# Altium schematic sheet Connectors.SchDoc
size Letter
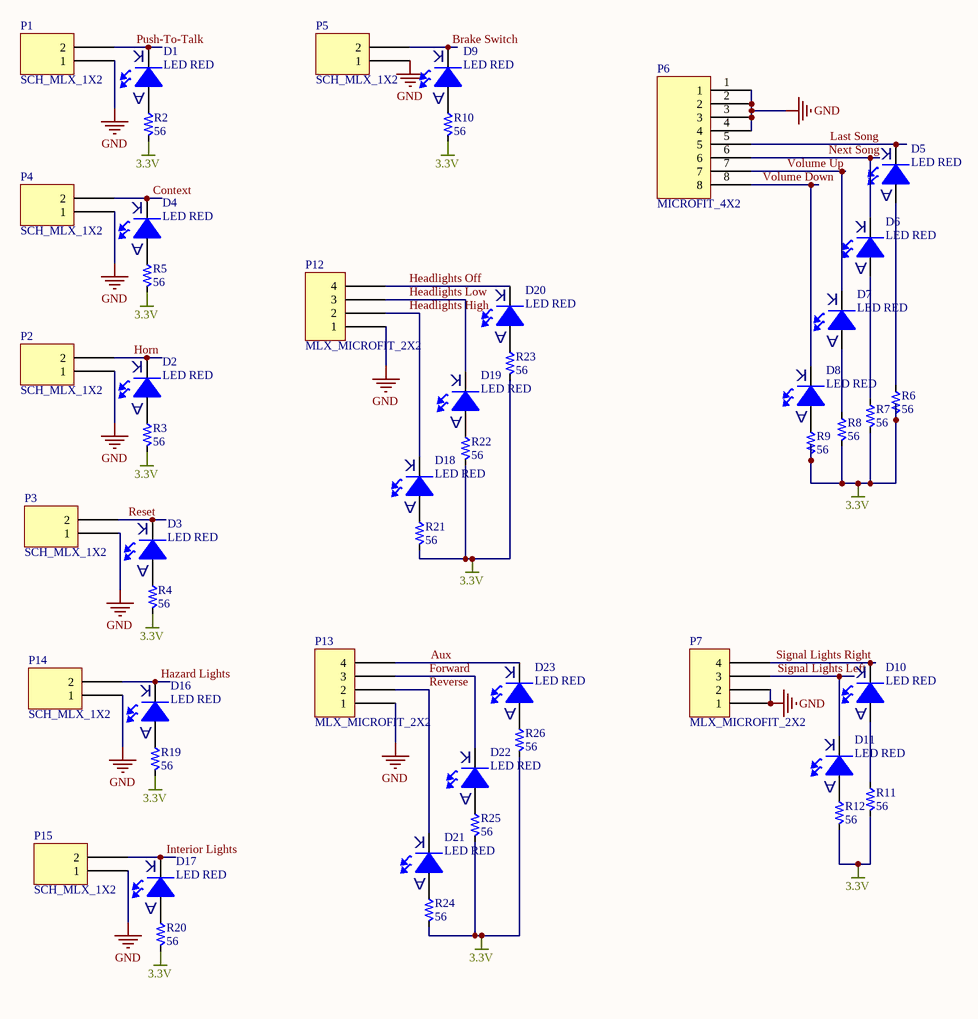
[diagram p0: Connectors.SchDoc]

## Parts
D1  LED RED  [RED LED]
D2  LED RED  [RED LED]
D3  LED RED  [RED LED]
D4  LED RED  [RED LED]
D5  LED RED  [RED LED]
D6  LED RED  [RED LED]
D7  LED RED  [RED LED]
D8  LED RED  [RED LED]
D9  LED RED  [RED LED]
D10  LED RED  [RED LED]
D11  LED RED  [RED LED]
D16  LED RED  [RED LED]
D17  LED RED  [RED LED]
D18  LED RED  [RED LED]
D19  LED RED  [RED LED]
D20  LED RED  [RED LED]
D21  LED RED  [RED LED]
D22  LED RED  [RED LED]
D23  LED RED  [RED LED]
P1  SCH_MLX_1X2  [PCB_MLX_MICROFIT_1X2]
P2  SCH_MLX_1X2  [PCB_MLX_MICROFIT_1X2]
P3  SCH_MLX_1X2  [PCB_MLX_MICROFIT_1X2]
P4  SCH_MLX_1X2  [PCB_MLX_MICROFIT_1X2]
P5  SCH_MLX_1X2  [PCB_MLX_MICROFIT_1X2]
P6  MICROFIT_4X2  [PCB_MLX_MICROFIT_4X2]
P7  MLX_MICROFIT_2X2  [MLX_MICROFIT_2X2]
P12  MLX_MICROFIT_2X2  [MLX_MICROFIT_2X2]
P13  MLX_MICROFIT_2X2  [MLX_MICROFIT_2X2]
P14  SCH_MLX_1X2  [PCB_MLX_MICROFIT_1X2]
P15  SCH_MLX_1X2  [PCB_MLX_MICROFIT_1X2]
R2  Resistance: 56  [PCB_GENERIC_SMD_0603]  (hidden comment: SCH_GENERIC_RESISTOR_0603)
R3  Resistance: 56  [PCB_GENERIC_SMD_0603]  (hidden comment: SCH_GENERIC_RESISTOR_0603)
R4  Resistance: 56  [PCB_GENERIC_SMD_0603]  (hidden comment: SCH_GENERIC_RESISTOR_0603)
R5  Resistance: 56  [PCB_GENERIC_SMD_0603]  (hidden comment: SCH_GENERIC_RESISTOR_0603)
R6  Resistance: 56  [PCB_GENERIC_SMD_0603]  (hidden comment: SCH_GENERIC_RESISTOR_0603)
R7  Resistance: 56  [PCB_GENERIC_SMD_0603]  (hidden comment: SCH_GENERIC_RESISTOR_0603)
R8  Resistance: 56  [PCB_GENERIC_SMD_0603]  (hidden comment: SCH_GENERIC_RESISTOR_0603)
R9  Resistance: 56  [PCB_GENERIC_SMD_0603]  (hidden comment: SCH_GENERIC_RESISTOR_0603)
R10  Resistance: 56  [PCB_GENERIC_SMD_0603]  (hidden comment: SCH_GENERIC_RESISTOR_0603)
R11  Resistance: 56  [PCB_GENERIC_SMD_0603]  (hidden comment: SCH_GENERIC_RESISTOR_0603)
R12  Resistance: 56  [PCB_GENERIC_SMD_0603]  (hidden comment: SCH_GENERIC_RESISTOR_0603)
R19  Resistance: 56  [PCB_GENERIC_SMD_0603]  (hidden comment: SCH_GENERIC_RESISTOR_0603)
R20  Resistance: 56  [PCB_GENERIC_SMD_0603]  (hidden comment: SCH_GENERIC_RESISTOR_0603)
R21  Resistance: 56  [PCB_GENERIC_SMD_0603]  (hidden comment: SCH_GENERIC_RESISTOR_0603)
R22  Resistance: 56  [PCB_GENERIC_SMD_0603]  (hidden comment: SCH_GENERIC_RESISTOR_0603)
R23  Resistance: 56  [PCB_GENERIC_SMD_0603]  (hidden comment: SCH_GENERIC_RESISTOR_0603)
R24  Resistance: 56  [PCB_GENERIC_SMD_0603]  (hidden comment: SCH_GENERIC_RESISTOR_0603)
R25  Resistance: 56  [PCB_GENERIC_SMD_0603]  (hidden comment: SCH_GENERIC_RESISTOR_0603)
R26  Resistance: 56  [PCB_GENERIC_SMD_0603]  (hidden comment: SCH_GENERIC_RESISTOR_0603)

## Nets
3.3V: R2.2 R3.2 R4.2 R5.2 R6.2 R7.2 R8.2 R9.2 R10.2 R11.2 R12.2 R19.2 R20.2 R21.2 R22.2 R23.2 R24.2 R25.2 R26.2
GND: P1.1 P2.1 P3.1 P4.1 P5.1 P6.1 P6.2 P6.3 P6.4 P7.1 P7.2 P12.1 P13.1 P14.1 P15.1
Aux: D23.1 P13.4
Brake Switch: D9.1 P5.2
Context: D4.1 P4.2
Forward: D22.1 P13.3
Hazard Lights: D16.1 P14.2
Headlights High: D18.1 P12.2
Headlights Low: D19.1 P12.3
Headlights Off: D20.1 P12.4
Horn: D2.1 P2.2
Interior Lights: D17.1 P15.2
Last Song: D5.1 P6.5
Next Song: D6.1 P6.6
Push-To-Talk: D1.1 P1.2
Reset: D3.1 P3.2
Reverse: D21.1 P13.2
Signal Lights Left: D11.1 P7.3
Signal Lights Right: D10.1 P7.4
Volume Down: D8.1 P6.8
Volume Up: D7.1 P6.7
NetD1_2: D1.2 R2.1
NetD2_2: D2.2 R3.1
NetD3_2: D3.2 R4.1
NetD4_2: D4.2 R5.1
NetD5_2: D5.2 R6.1
NetD6_2: D6.2 R7.1
NetD7_2: D7.2 R8.1
NetD8_2: D8.2 R9.1
NetD9_2: D9.2 R10.1
NetD10_2: D10.2 R11.1
NetD11_2: D11.2 R12.1
NetD16_2: D16.2 R19.1
NetD17_2: D17.2 R20.1
NetD18_2: D18.2 R21.1
NetD19_2: D19.2 R22.1
NetD20_2: D20.2 R23.1
NetD21_2: D21.2 R24.1
NetD22_2: D22.2 R25.1
NetD23_2: D23.2 R26.1

## Notes on the sheet
- (in symbol LED RED) K; A

## Library data of the parts
P6 = SCH_MLX_MICROFIT_4X2: Molex Microfit Connector 4x2
R2-R12 R19-R26 = SCH_GENERIC_RESISTOR_0603: Generic SMD resistor 0603